# EAGLE design fetboard (EAGLE 6.2)
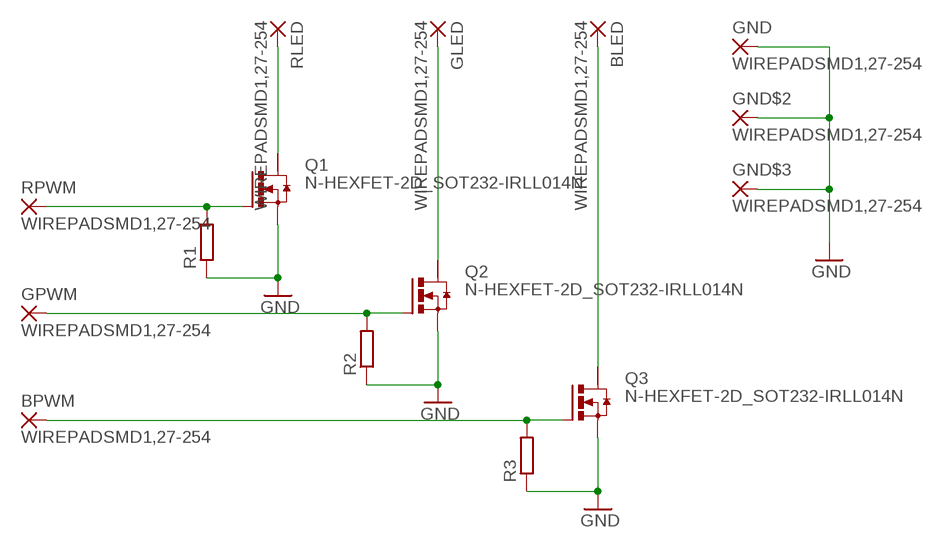
[diagram p0: schematic, sheet 1]

## Parts
BLED  WIREPADSMD1,27-254  [SMD1,27-2,54]
BPWM  WIREPADSMD1,27-254  [SMD1,27-2,54]
GLED  WIREPADSMD1,27-254  [SMD1,27-2,54]
GND  WIREPADSMD1,27-254  [SMD1,27-2,54]
GND$2  WIREPADSMD1,27-254  [SMD1,27-2,54]
GND$3  WIREPADSMD1,27-254  [SMD1,27-2,54]
GPWM  WIREPADSMD1,27-254  [SMD1,27-2,54]
Q1  N-HEXFET-2D_SOT232-IRLL014N  [SOT223]
Q2  N-HEXFET-2D_SOT232-IRLL014N  [SOT223]
Q3  N-HEXFET-2D_SOT232-IRLL014N  [SOT223]
R1  R-EU_R1206  [R1206]
R2  R-EU_R1206  [R1206]
R3  R-EU_R1206  [R1206]
RLED  WIREPADSMD1,27-254  [SMD1,27-2,54]
RPWM  WIREPADSMD1,27-254  [SMD1,27-2,54]

## Nets
GND: GND$2.1(P) GND$3.1(P) GND.1(P) Q1.3(S) Q2.3(S) Q3.3(S) R1.1 R2.1 R3.1
N$1: Q1.1(G) R1.2 RPWM.1(P)
N$2: GPWM.1(P) Q2.1(G) R2.2
N$3: BPWM.1(P) Q3.1(G) R3.2
N$4: Q1.2(D) RLED.1(P)
N$5: GLED.1(P) Q2.2(D)
N$6: BLED.1(P) Q3.2(D)
Unconnected: Q1.4(D) Q2.4(D) Q3.4(D)

## Library data of the parts
BLED BPWM GLED GND GND$2 GND$3 GPWM RLED RPWM = wirepad:WIREPAD: Wire PAD connect wire on PCB
Q1-Q3 = transistor-power:N-HEXFET-2D_?-*: HEXFET® Power MOSFET 2 Drain connects http://www.irf.com/product-info/datasheets/data/irll014n.pdf
R1-R3 = resistor:R-EU_: RESISTOR, European symbol

## Board
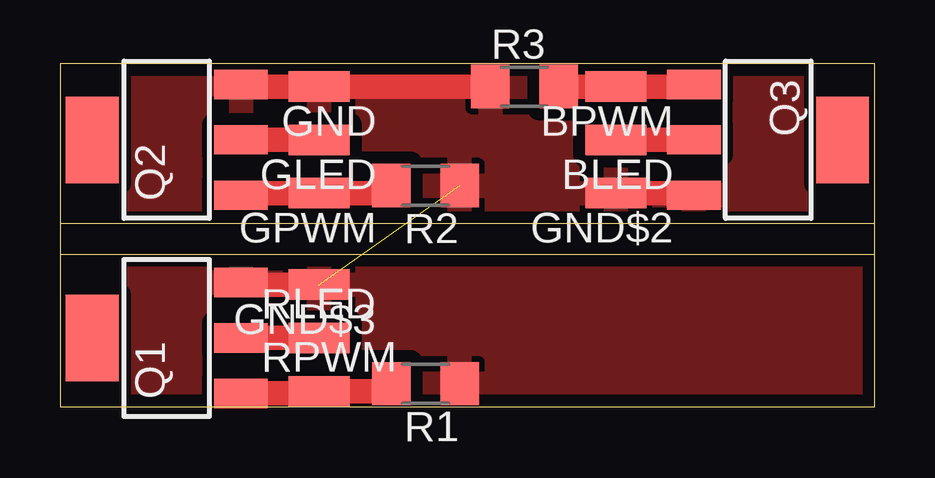
[diagram p1: board, top side]

Size 33.97 x 14.28 mm. Coordinates in mm from the lower left corner, seen from the top.
Outline: 0,7.62 0,14.28 33.96,14.28 33.96,0 0,0 0,6.35
Outline: 0,6.35 33.97,6.35 33.97,7.62 0,7.62
Outline: 0,7.62 0,6.35
Copper layers (1*16): Top 0.035mm / dielectric 1.5mm / Bottom 0.035mm
Design rules: minimum track width 10mil, minimum drill 24mil, track to track 20mil, track to pad 20mil, pad to pad 20mil, via to via 20mil, smd to smd 8mil, copper to edge 20mil, drill to drill 8mil, minimum pad ring 10mil, minimum via ring 8mil, stop-mask expansion 4mil, vias tented up to drill 0mil, thermal gap 10mil

### Footprints (pad centres in the part's own frame; a part is rotated, then mirrored left to right if it is on the bottom)
SMD1,27-2,54 = smd 1.27 x 2.54: 1 0,0
SOT223 = smd 1.219 x 2.235: 1 -2.311,-3.099; 2 0,-3.099; 3 2.311,-3.099 | smd 3.6 x 2.2: 4 0,3.099
R1206 = smd 1.6 x 1.803: 1 -1.422,0; 2 1.422,0

### Placement (x,y rotation side)
BLED  23.18,11.11 90 top
BPWM  23.18,13.34 90 top
GLED  10.79,11.11 90 top
GND  10.79,13.34 90 top
GND$2  23.18,8.89 90 top
GND$3  10.79,5.08 90 top
GPWM  10.79,8.89 90 top
Q1  4.45,2.86 90 top
Q2  4.45,11.11 90 top
Q3  29.53,11.11 270 top
R1  15.24,0.95 180 top
R2  15.24,9.21 180 top
R3  19.37,13.34 0 top
RLED  10.79,2.86 270 top
RPWM  10.79,0.64 270 top

### Tracks (layer width: path | path; a pad name or v marks a point on that pad's centre or on a via)
GND  (1 unrouted)
  Top 1.016: Q2.3 7.54,13.34 GND.1 R3.1 | Q1.3 7.54,5.08 GND$3.1 | Q3.3 26.43,8.89 GND$2.1
  pour Top: -1.27,15.88 36.51,15.88 36.51,-0.64 -0.32,-0.64 -2.54,14.29
N$1
  Top 1.016: Q1.1 10.79,0.55 RPWM.1 13.82,0.64 R1.2
N$2
  Top 1.016: Q2.1 7.54,8.89 GPWM.1 13.82,8.89 R2.2
N$3
  Top 1.016: Q3.1 26.43,13.34 BPWM.1 R3.2
N$4
  Top 1.016: Q1.2 RLED.1
N$5
  Top 1.016: GLED.1 Q2.2
N$6
  Top 1.016: Q3.2 BLED.1
N$7
  cutout Top: 8.89,3.49 6.67,3.49 6.67,4.45 8.89,4.45
  cutout Top: 27.62,9.53 25.4,9.53 25.4,10.48 27.62,10.48